# EAGLE schematic DSKY_control_circuitry (EAGLE 6.6.0)
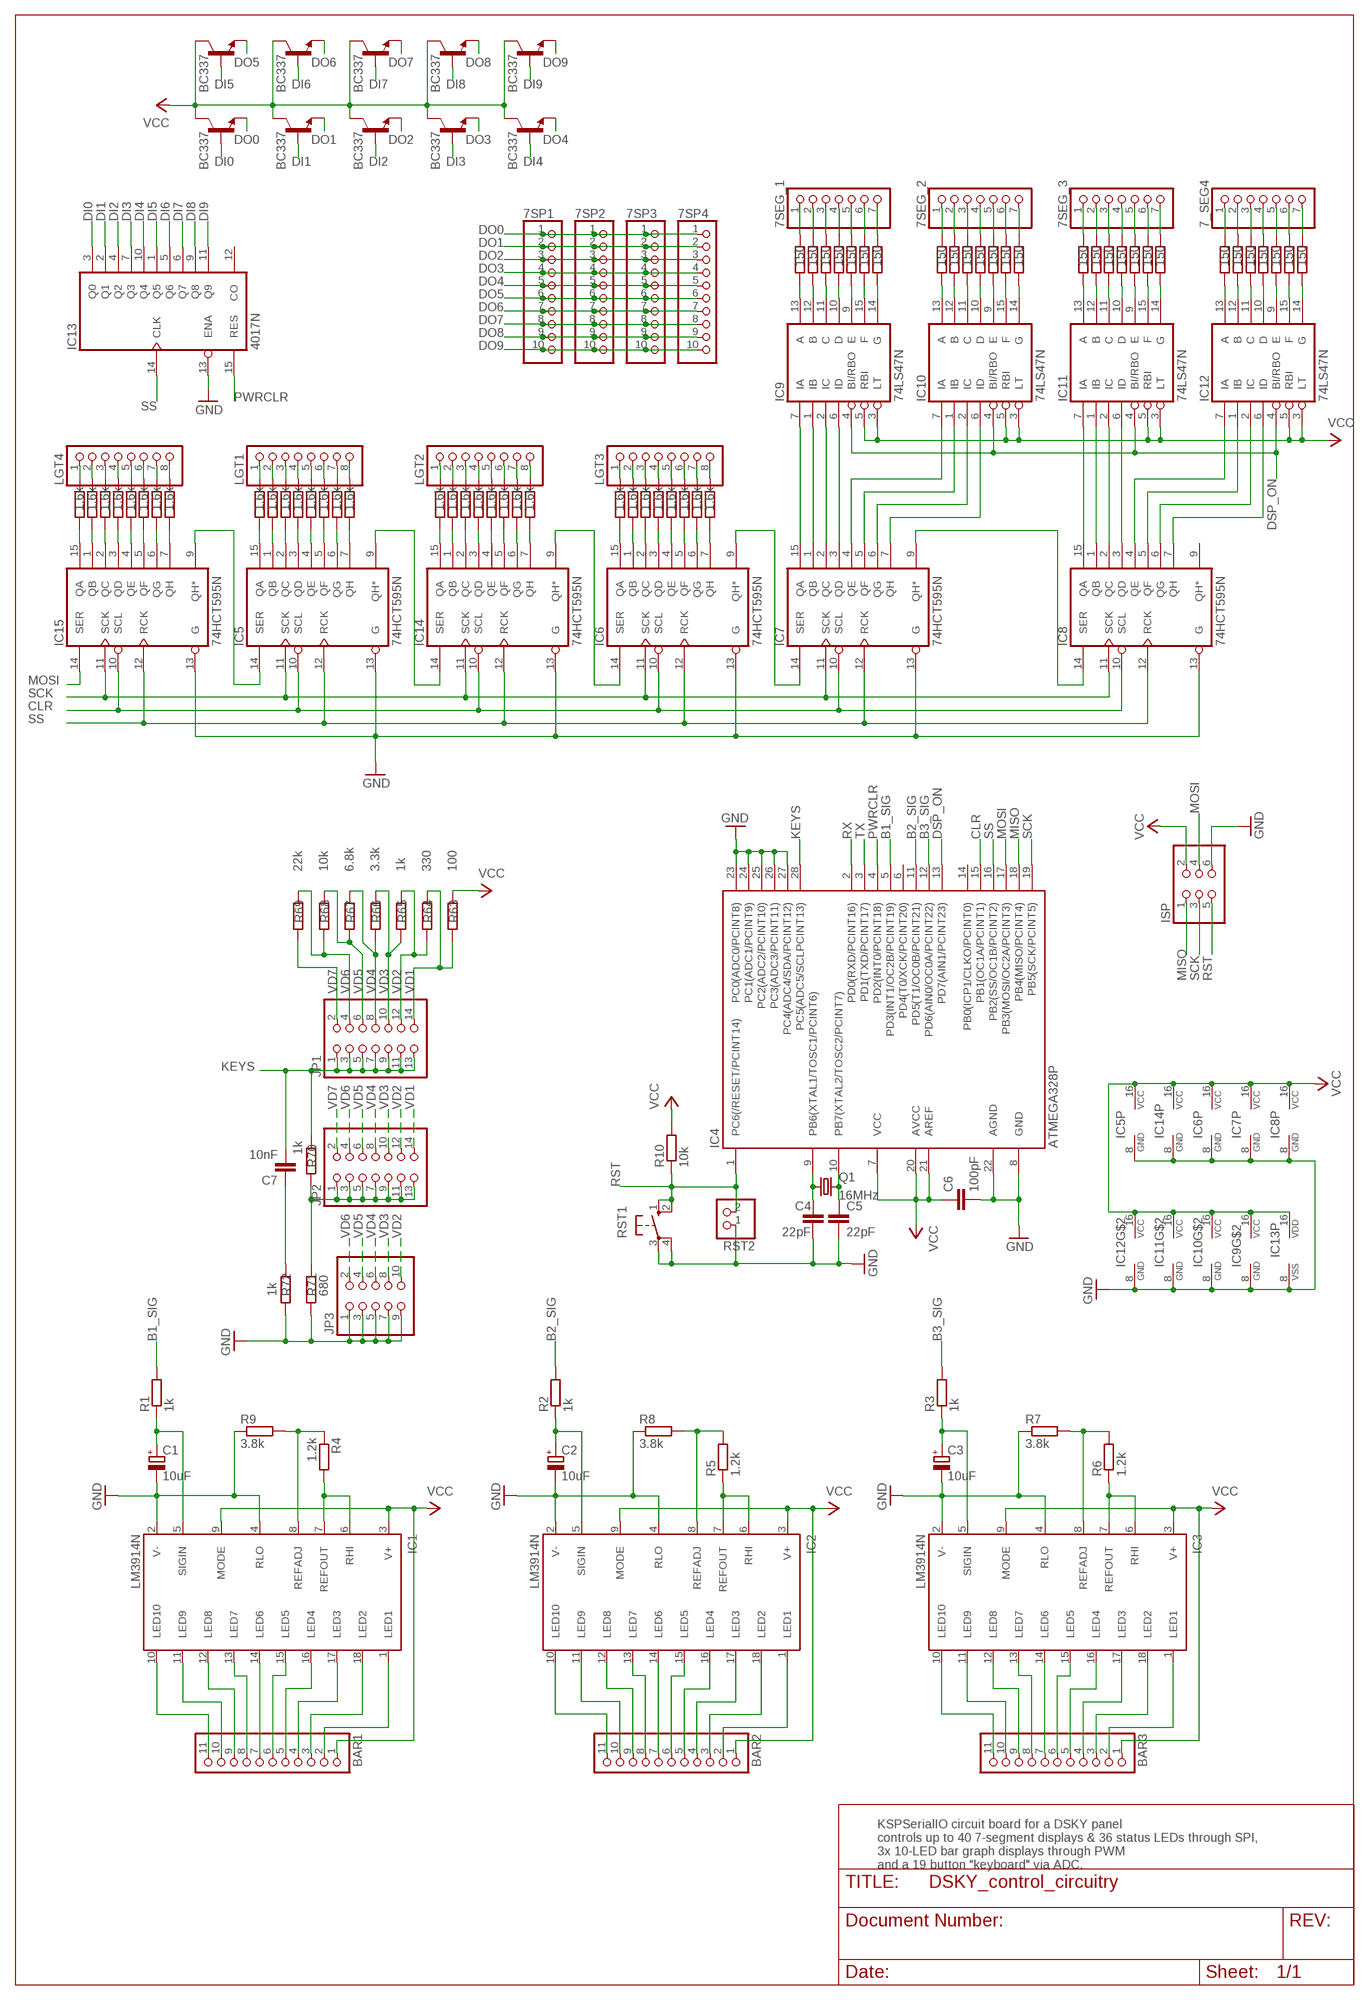
[diagram p0: schematic, sheet 1]

## Parts
7_SEG4  PINHD-1X7  [1X07]
7SEG_1  PINHD-1X7  [1X07]
7SEG_2  PINHD-1X7  [1X07]
7SEG_3  PINHD-1X7  [1X07]
7SP1  PINHD-1X10  [1X10]
7SP2  PINHD-1X10  [1X10]
7SP3  PINHD-1X10  [1X10]
7SP4  PINHD-1X10  [1X10]
BAR1  PINHD-1X11  [1X11]
BAR2  PINHD-1X11  [1X11]
BAR3  PINHD-1X11  [1X11]
C1  10uF  CPOL-EUE1.8-4  [E1,8-4]
C2  10uF  CPOL-EUE1.8-4  [E1,8-4]
C3  10uF  CPOL-EUE1.8-4  [E1,8-4]
C4  22pF  C-EU025-024X044  [C025-024X044]
C5  22pF  C-EU025-024X044  [C025-024X044]
C6  100pF  C-EU025-024X044  [C025-024X044]
C7  10nF  C-EU025-024X044  [C025-024X044]
IC1  LM3914N  [DIL18]
IC2  LM3914N  [DIL18]
IC3  LM3914N  [DIL18]
IC4  ATMEGA328P  MEGA48/88/168-PU  [DIL28-3]
IC5  74HCT595N  [DIL16]
IC6  74HCT595N  [DIL16]
IC7  74HCT595N  [DIL16]
IC8  74HCT595N  [DIL16]
IC9  74LS47N  [DIL16]
IC10  74LS47N  [DIL16]
IC11  74LS47N  [DIL16]
IC12  74LS47N  [DIL16]
IC13  4017N  [DIL16]
IC14  74HCT595N  [DIL16]
IC15  74HCT595N  [DIL16]
ISP  PINHD-2X3  [2X03]
JP1  PINHD-2X7  [2X07]
JP2  PINHD-2X7  [2X07]
JP3  PINHD-2X5  [2X05]
LGT1  PINHD-1X8  [1X08]
LGT2  PINHD-1X8  [1X08]
LGT3  PINHD-1X8  [1X08]
LGT4  PINHD-1X8  [1X08]
Q1  16MHz  CRYSTALHC49S  [HC49/S]
Q2  BC337  [TO92]
Q3  BC337  [TO92]
Q4  BC337  [TO92]
Q5  BC337  [TO92]
Q6  BC337  [TO92]
Q7  BC337  [TO92]
Q8  BC337  [TO92]
Q9  BC337  [TO92]
Q10  BC337  [TO92]
Q11  BC337  [TO92]
R1  1k  R-EU_0204/2V  [0204V]
R2  1k  R-EU_0204/2V  [0204V]
R3  1k  R-EU_0204/2V  [0204V]
R4  1.2k  R-EU_0204/2V  [0204V]
R5  1.2k  R-EU_0204/2V  [0204V]
R6  1.2k  R-EU_0204/2V  [0204V]
R7  3.8k  R-EU_0204/2V  [0204V]
R8  3.8k  R-EU_0204/2V  [0204V]
R9  3.8k  R-EU_0204/2V  [0204V]
R10  10k  R-EU_0204/2V  [0204V]
R11  150  R-EU_0204/2V  [0204V]
R12  150  R-EU_0204/2V  [0204V]
R13  150  R-EU_0204/2V  [0204V]
R14  150  R-EU_0204/2V  [0204V]
R15  150  R-EU_0204/2V  [0204V]
R16  150  R-EU_0204/2V  [0204V]
R17  150  R-EU_0204/2V  [0204V]
R18  150  R-EU_0204/2V  [0204V]
R19  150  R-EU_0204/2V  [0204V]
R20  150  R-EU_0204/2V  [0204V]
R21  150  R-EU_0204/2V  [0204V]
R22  150  R-EU_0204/2V  [0204V]
R23  150  R-EU_0204/2V  [0204V]
R24  150  R-EU_0204/2V  [0204V]
R25  150  R-EU_0204/2V  [0204V]
R26  150  R-EU_0204/2V  [0204V]
R27  150  R-EU_0204/2V  [0204V]
R28  150  R-EU_0204/2V  [0204V]
R29  150  R-EU_0204/2V  [0204V]
R30  150  R-EU_0204/2V  [0204V]
R31  150  R-EU_0204/2V  [0204V]
R32  150  R-EU_0204/2V  [0204V]
R33  150  R-EU_0204/2V  [0204V]
R34  150  R-EU_0204/2V  [0204V]
R35  150  R-EU_0204/2V  [0204V]
R36  150  R-EU_0204/2V  [0204V]
R37  150  R-EU_0204/2V  [0204V]
R38  150  R-EU_0204/2V  [0204V]
R39  1.6k  R-EU_0204/2V  [0204V]
R40  1.6k  R-EU_0204/2V  [0204V]
R41  1.6k  R-EU_0204/2V  [0204V]
R42  1.6k  R-EU_0204/2V  [0204V]
R43  1.6k  R-EU_0204/2V  [0204V]
R44  1.6k  R-EU_0204/2V  [0204V]
R45  1.6k  R-EU_0204/2V  [0204V]
R46  1.6k  R-EU_0204/2V  [0204V]
R47  1.6k  R-EU_0204/2V  [0204V]
R48  1.6k  R-EU_0204/2V  [0204V]
R49  1.6k  R-EU_0204/2V  [0204V]
R50  1.6k  R-EU_0204/2V  [0204V]
R51  1.6k  R-EU_0204/2V  [0204V]
R52  1.6k  R-EU_0204/2V  [0204V]
R53  1.6k  R-EU_0204/2V  [0204V]
R54  1.6k  R-EU_0204/2V  [0204V]
R55  1.6k  R-EU_0204/2V  [0204V]
R56  1.6k  R-EU_0204/2V  [0204V]
R57  1.6k  R-EU_0204/2V  [0204V]
R58  1.6k  R-EU_0204/2V  [0204V]
R59  1.6k  R-EU_0204/2V  [0204V]
R60  1.6k  R-EU_0204/2V  [0204V]
R61  1.6k  R-EU_0204/2V  [0204V]
R62  1.6k  R-EU_0204/2V  [0204V]
R63  100  R-EU_0204/2V  [0204V]
R64  330  R-EU_0204/2V  [0204V]
R65  1k  R-EU_0204/2V  [0204V]
R66  3.3k  R-EU_0204/2V  [0204V]
R67  6.8k  R-EU_0204/2V  [0204V]
R68  10k  R-EU_0204/2V  [0204V]
R69  22k  R-EU_0204/2V  [0204V]
R70  1k  R-EU_0204/2V  [0204V]
R71  680  R-EU_0204/2V  [0204V]
R72  1k  R-EU_0204/2V  [0204V]
R73  1.6k  R-EU_0204/2V  [0204V]
R74  1.6k  R-EU_0204/2V  [0204V]
R75  1.6k  R-EU_0204/2V  [0204V]
R76  1.6k  R-EU_0204/2V  [0204V]
R77  1.6k  R-EU_0204/2V  [0204V]
R78  1.6k  R-EU_0204/2V  [0204V]
R79  1.6k  R-EU_0204/2V  [0204V]
R80  1.6k  R-EU_0204/2V  [0204V]
RST1  10-XX  [B3F-10XX]
RST2  PINHD-1X2  [1X02]

## Nets
AASDASD: IC5.14(SER) IC15.9(QH*)
B1_SIG: IC4.5(PD3(INT1/OC2B/PCINT19)) R1.2
B2_SIG: IC4.11(PD5(T1/OC0B/PCINT21)) R2.2
B3_SIG: IC4.12(PD6(AIN0/OC0A/PCINT22)) R3.2
CLR: IC4.15(PB1(OC1A/PCINT1)) IC5.10(SCL) IC6.10(SCL) IC7.10(SCL) IC8.10(SCL) IC14.10(SCL) IC15.10(SCL)
DI0: IC13.3(Q0) Q2.2(B)
DI1: IC13.2(Q1) Q3.2(B)
DI2: IC13.4(Q2) Q4.2(B)
DI3: IC13.7(Q3) Q5.2(B)
DI4: IC13.10(Q4) Q6.2(B)
DI5: IC13.1(Q5) Q7.2(B)
DI6: IC13.5(Q6) Q8.2(B)
DI7: IC13.6(Q7) Q9.2(B)
DI8: IC13.9(Q8) Q10.2(B)
DI9: IC13.11(Q9) Q11.2(B)
DO0: 7SP1.1 7SP2.1 7SP3.1 7SP4.1 Q2.1(E)
DO1: 7SP1.2 7SP2.2 7SP3.2 7SP4.2 Q3.1(E)
DO2: 7SP1.3 7SP2.3 7SP3.3 7SP4.3 Q4.1(E)
DO3: 7SP1.4 7SP2.4 7SP3.4 7SP4.4 Q5.1(E)
DO4: 7SP1.5 7SP2.5 7SP3.5 7SP4.5 Q6.1(E)
DO5: 7SP1.6 7SP2.6 7SP3.6 7SP4.6 Q7.1(E)
DO6: 7SP1.7 7SP2.7 7SP3.7 7SP4.7 Q8.1(E)
DO7: 7SP1.8 7SP2.8 7SP3.8 7SP4.8 Q9.1(E)
DO8: 7SP1.9 7SP2.9 7SP3.9 7SP4.9 Q10.1(E)
DO9: 7SP1.10 7SP2.10 7SP3.10 7SP4.10 Q11.1(E)
DSP_ON: IC4.13(PD7(AIN1/PCINT23)) IC9.4(BI/RBO) IC10.4(BI/RBO) IC11.4(BI/RBO) IC12.4(BI/RBO)
GND: C1.- C2.- C3.- C4.2 C5.2 C6.2 IC1.2(V-) IC1.4(RLO) IC2.2(V-) IC2.4(RLO) IC3.2(V-) IC3.4(RLO) IC4.8(GND) IC4.22(AGND) IC4.23(PC0(ADC0/PCINT8)) IC4.24(PC1(ADC1/PCINT9)) IC4.25(PC2(ADC2/PCINT10)) IC4.26(PC3(ADC3/PCINT11)) IC4.27(PC4(ADC4/SDA/PCINT12)) IC5.8(GND) IC5.13(G) IC6.8(GND) IC6.13(G) IC7.8(GND) IC7.13(G) IC8.8(GND) IC8.13(G) IC9.8(GND) IC10.8(GND) IC11.8(GND) IC12.8(GND) IC13.8(VSS) IC13.13(ENA) IC14.8(GND) IC14.13(G) IC15.13(G) ISP.6 JP3.1 JP3.3 JP3.5 JP3.7 JP3.9 R7.1 R8.1 R9.1 R71.1 R72.1 RST1.3(P) RST1.4(P1) RST2.1
KEYS: C7.2 IC4.28(PC5(ADC5/SCLPCINT13)) JP1.1 JP1.3 JP1.5 JP1.7 JP1.9 JP1.11 JP1.13 R70.2
MISO: IC4.18(PB4(MISO/PCINT4)) ISP.1
MOSI: IC4.17(PB3(MOSI/OC2A/PCINT3)) IC15.14(SER) ISP.4
N$1: BAR1.11 IC1.10(LED10)
N$2: BAR1.10 IC1.11(LED9)
N$3: BAR1.9 IC1.12(LED8)
N$4: BAR1.8 IC1.13(LED7)
N$5: BAR1.7 IC1.14(LED6)
N$6: BAR1.6 IC1.15(LED5)
N$7: BAR1.5 IC1.16(LED4)
N$8: BAR1.4 IC1.17(LED3)
N$9: BAR1.3 IC1.18(LED2)
N$10: BAR1.2 IC1.1(LED1)
N$11: IC1.8(REFADJ) R4.1 R9.2
N$12: C1.+ IC1.5(SIGIN) R1.1
N$13: IC7.15(QA) IC9.7(IA)
N$14: IC1.6(RHI) IC1.7(REFOUT) R4.2
N$15: C4.1 IC4.9(PB6(XTAL1/TOSC1/PCINT6)) Q1.1
N$16: IC2.6(RHI) IC2.7(REFOUT) R5.1
N$17: IC2.8(REFADJ) R5.2 R8.2
N$18: C2.+ IC2.5(SIGIN) R2.1
N$19: C5.1 IC4.10(PB7(XTAL2/TOSC2/PCINT7)) Q1.2
N$20: C3.+ IC3.5(SIGIN) R3.1
N$21: IC3.8(REFADJ) R6.2 R7.2
N$22: IC3.6(RHI) IC3.7(REFOUT) R6.1
N$23: IC7.1(QB) IC9.1(IB)
N$24: BAR3.7 IC3.14(LED6)
N$25: BAR3.8 IC3.13(LED7)
N$26: BAR3.9 IC3.12(LED8)
N$27: BAR3.10 IC3.11(LED9)
N$28: BAR3.11 IC3.10(LED10)
N$29: BAR3.6 IC3.15(LED5)
N$30: BAR3.5 IC3.16(LED4)
N$31: BAR3.4 IC3.17(LED3)
N$32: BAR3.3 IC3.18(LED2)
N$33: BAR3.2 IC3.1(LED1)
N$34: BAR2.7 IC2.14(LED6)
N$35: BAR2.6 IC2.15(LED5)
N$36: BAR2.5 IC2.16(LED4)
N$37: BAR2.4 IC2.17(LED3)
N$38: BAR2.3 IC2.18(LED2)
N$39: BAR2.2 IC2.1(LED1)
N$40: BAR2.8 IC2.13(LED7)
N$41: BAR2.9 IC2.12(LED8)
N$42: BAR2.10 IC2.11(LED9)
N$43: BAR2.11 IC2.10(LED10)
N$44: IC7.2(QC) IC9.2(IC)
N$45: IC7.3(QD) IC9.6(ID)
N$46: IC7.4(QE) IC10.7(IA)
N$47: IC7.5(QF) IC10.1(IB)
N$48: IC7.6(QG) IC10.2(IC)
N$49: IC7.7(QH) IC10.6(ID)
N$50: IC8.15(QA) IC11.7(IA)
N$51: IC8.1(QB) IC11.1(IB)
N$52: IC8.2(QC) IC11.2(IC)
N$53: IC8.3(QD) IC11.6(ID)
N$54: IC8.4(QE) IC12.7(IA)
N$55: IC8.5(QF) IC12.1(IB)
N$56: IC8.6(QG) IC12.2(IC)
N$57: IC8.7(QH) IC12.6(ID)
N$58: IC12.14(G) R38.1
N$59: IC12.15(F) R37.1
N$60: IC12.9(E) R36.1
N$61: IC12.10(D) R35.1
N$62: IC12.11(C) R34.1
N$63: IC12.12(B) R33.1
N$64: IC12.13(A) R32.1
N$65: IC11.14(G) R31.1
N$66: IC11.15(F) R30.1
N$67: IC11.9(E) R29.1
N$68: IC11.10(D) R28.1
N$69: IC11.11(C) R27.1
N$70: IC11.12(B) R26.1
N$71: IC11.13(A) R25.1
N$72: IC10.14(G) R24.1
N$73: IC10.15(F) R23.1
N$74: IC10.9(E) R22.1
N$75: IC10.10(D) R21.1
N$76: IC10.11(C) R20.1
N$77: IC10.12(B) R19.1
N$78: IC10.13(A) R18.1
N$79: 7SEG_2.1 R18.2
N$80: 7SEG_2.2 R19.2
N$81: 7SEG_2.3 R20.2
N$82: 7SEG_2.4 R21.2
N$83: 7SEG_2.5 R22.2
N$84: 7SEG_2.6 R23.2
N$85: 7SEG_2.7 R24.2
N$86: IC6.14(SER) IC14.9(QH*)
N$87: IC6.9(QH*) IC7.14(SER)
N$88: IC7.9(QH*) IC8.14(SER)
N$89: IC5.9(QH*) IC14.14(SER)
N$90: 7SEG_3.1 R25.2
N$91: 7SEG_3.2 R26.2
N$92: 7SEG_3.3 R27.2
N$93: 7SEG_3.4 R28.2
N$94: 7SEG_3.5 R29.2
N$95: 7SEG_3.6 R30.2
N$96: 7SEG_3.7 R31.2
N$97: 7_SEG4.1 R32.2
N$98: 7_SEG4.2 R33.2
N$99: 7_SEG4.3 R34.2
N$100: 7_SEG4.4 R35.2
N$101: 7_SEG4.5 R36.2
N$102: 7_SEG4.6 R37.2
N$103: 7_SEG4.7 R38.2
N$104: IC9.14(G) R17.1
N$105: IC9.15(F) R16.1
N$106: IC9.9(E) R15.1
N$107: IC9.10(D) R14.1
N$108: IC9.11(C) R13.1
N$109: IC9.12(B) R12.1
N$110: IC9.13(A) R11.1
N$111: 7SEG_1.1 R11.2
N$112: 7SEG_1.2 R12.2
N$113: 7SEG_1.3 R13.2
N$114: 7SEG_1.4 R14.2
N$115: 7SEG_1.5 R15.2
N$116: 7SEG_1.6 R16.2
N$117: 7SEG_1.7 R17.2
N$118: IC5.15(QA) R39.1
N$119: IC5.1(QB) R40.1
N$120: IC5.2(QC) R41.1
N$121: IC5.3(QD) R42.1
N$122: IC5.4(QE) R43.1
N$123: IC5.5(QF) R44.1
N$124: IC5.6(QG) R45.1
N$125: IC5.7(QH) R46.1
N$126: IC14.15(QA) R47.1
N$127: IC14.1(QB) R48.1
N$128: IC14.2(QC) R49.1
N$129: IC14.3(QD) R50.1
N$130: IC14.4(QE) R51.1
N$131: IC14.5(QF) R52.1
N$132: IC14.6(QG) R53.1
N$133: IC14.7(QH) R54.1
N$134: IC6.15(QA) R55.1
N$135: IC6.1(QB) R56.1
N$136: IC6.2(QC) R57.1
N$137: IC6.3(QD) R58.1
N$138: IC6.4(QE) R59.1
N$139: IC6.5(QF) R60.1
N$140: IC6.6(QG) R61.1
N$141: IC6.7(QH) R62.1
N$142: LGT3.8 R62.2
N$143: LGT3.7 R61.2
N$144: LGT3.6 R60.2
N$145: LGT3.5 R59.2
N$146: LGT3.4 R58.2
N$147: LGT3.3 R57.2
N$148: LGT3.2 R56.2
N$149: LGT3.1 R55.2
N$150: LGT2.8 R54.2
N$151: LGT2.7 R53.2
N$152: LGT2.6 R52.2
N$153: LGT2.5 R51.2
N$154: LGT2.4 R50.2
N$155: LGT2.3 R49.2
N$156: LGT2.2 R48.2
N$157: LGT2.1 R47.2
N$158: LGT1.8 R46.2
N$159: LGT1.7 R45.2
N$160: LGT1.6 R44.2
N$161: LGT1.5 R43.2
N$162: LGT1.4 R42.2
N$163: LGT1.3 R41.2
N$164: LGT1.2 R40.2
N$165: LGT1.1 R39.2
N$168: IC15.15(QA) R73.1
N$173: JP2.1 JP2.3 JP2.5 JP2.7 JP2.9 JP2.11 JP2.13 R70.1 R71.2
N$176: IC15.1(QB) R74.1
N$177: IC15.2(QC) R75.1
N$178: C7.1 R72.2
N$179: IC15.3(QD) R76.1
N$180: IC15.4(QE) R77.1
N$181: IC15.5(QF) R78.1
N$182: IC15.6(QG) R79.1
N$183: IC15.7(QH) R80.1
N$184: LGT4.8 R80.2
N$185: LGT4.7 R79.2
N$186: LGT4.6 R78.2
N$187: LGT4.5 R77.2
N$188: LGT4.4 R76.2
N$189: LGT4.3 R75.2
N$190: LGT4.2 R74.2
N$191: LGT4.1 R73.2
PWRCLR: IC4.4(PD2(INT0/PCINT18)) IC13.15(RES)
RST: IC4.1(PC6(/RESET/PCINT14)) ISP.5 R10.1 RST1.1(S) RST1.2(S1) RST2.2
RX: IC4.2(PD0(RXD/PCINT16))
SCK: IC4.19(PB5(SCK/PCINT5)) IC5.11(SCK) IC6.11(SCK) IC7.11(SCK) IC8.11(SCK) IC14.11(SCK) IC15.11(SCK) ISP.3
SS: IC4.16(PB2(SS/OC1B/PCINT2)) IC5.12(RCK) IC6.12(RCK) IC7.12(RCK) IC8.12(RCK) IC13.14(CLK) IC14.12(RCK) IC15.12(RCK)
TX: IC4.3(PD1(TXD/PCINT17))
VCC: BAR1.1 BAR2.1 BAR3.1 C6.1 IC1.3(V+) IC1.9(MODE) IC2.3(V+) IC2.9(MODE) IC3.3(V+) IC3.9(MODE) IC4.7(VCC) IC4.20(AVCC) IC4.21(AREF) IC5.16(VCC) IC6.16(VCC) IC7.16(VCC) IC8.16(VCC) IC9.3(LT) IC9.5(RBI) IC9.16(VCC) IC10.3(LT) IC10.5(RBI) IC10.16(VCC) IC11.3(LT) IC11.5(RBI) IC11.16(VCC) IC12.3(LT) IC12.5(RBI) IC12.16(VCC) IC13.16(VDD) IC14.16(VCC) ISP.2 Q2.3(C) Q3.3(C) Q4.3(C) Q5.3(C) Q6.3(C) Q7.3(C) Q8.3(C) Q9.3(C) Q10.3(C) Q11.3(C) R10.2 R63.2
VD1: JP1.14 JP2.14 R63.1 R64.2
VD2: JP1.12 JP2.12 JP3.10 R64.1 R65.2
VD3: JP1.10 JP2.10 JP3.8 R65.1 R66.2
VD4: JP1.8 JP2.8 JP3.6 R66.1 R67.2
VD5: JP1.6 JP2.6 JP3.4 R67.1 R68.2
VD6: JP1.4 JP2.4 JP3.2 R68.1 R69.2
VD7: JP1.2 JP2.2 R69.1
Unconnected: IC4.6(PD4(T0/XCK/PCINT20)) IC4.14(PB0(ICP1/CLKO/PCINT0)) IC8.9(QH*) IC13.12(CO)

## Notes on the sheet
- KSPSerialIO circuit board for a DSKY panel
  controls up to 40 7-segment displays & 36 status LEDs through SPI,
  3x 10-LED bar graph displays through PWM
  and a 19 button "keyboard" via ADC.

## Power pins joined to a net without a drawn wire
GND: IC15.8(GND)
VCC: IC15.16(VCC)

## Library data of the parts
7_SEG4 7SEG_1-7SEG_3 = pinhead:PINHD-1X7: PIN HEADER
7SP1-7SP4 = pinhead:PINHD-1X10: PIN HEADER
BAR1-BAR3 = pinhead:PINHD-1X11: PIN HEADER
C1-C3 = rcl:CPOL-EU: POLARIZED CAPACITOR, European symbol
C4-C7 = rcl:C-EU: CAPACITOR, European symbol
IC1-IC3 = national-semiconductor:LM391: Dot/Bar Display Driver Source: Data sheet LM3915 <http://www.national.com/ds/LM/LM3915.pdf> Data sheet LM3914 <http://www.national.com/ds/LM/LM3914.pdf>
IC4 = avr-6:MEGA48/88/168-PU
IC5-IC8 IC14 IC15 = 74xx-eu:74*595: 8-bit SHIFT REGISTER, output latch
IC9-IC12 = 74xx-eu:74*47: BCD to seven segment DECODER/DRIVER Source: http://www.ee.washington.edu/stores/DataSheets/74ls/74ls47.pdf
IC13 = 40xx:4017: COUNTER/DIVIDER
ISP = pinhead:PINHD-2X3: PIN HEADER
JP1 JP2 = pinhead:PINHD-2X7: PIN HEADER
JP3 = pinhead:PINHD-2X5: PIN HEADER
LGT1-LGT4 = pinhead:PINHD-1X8: PIN HEADER
Q1 = crystal:CRYSTAL: CRYSTAL; OC_FARNELL: 1667008; OC_NEWARK: unknown
Q2-Q11 = transistor-npn:BC337*: NPN Transistor
R1-R80 = rcl:R-EU_: RESISTOR, European symbol
RST1 = switch-omron:10-XX: OMRON SWITCH; MPN: B3F-1000; OC_FARNELL: 176432; OC_NEWARK: 36M3542
RST2 = pinhead:PINHD-1X2: PIN HEADER